# Altium project Measurement of NO2 using an electrochemical sensor.PrjPcb
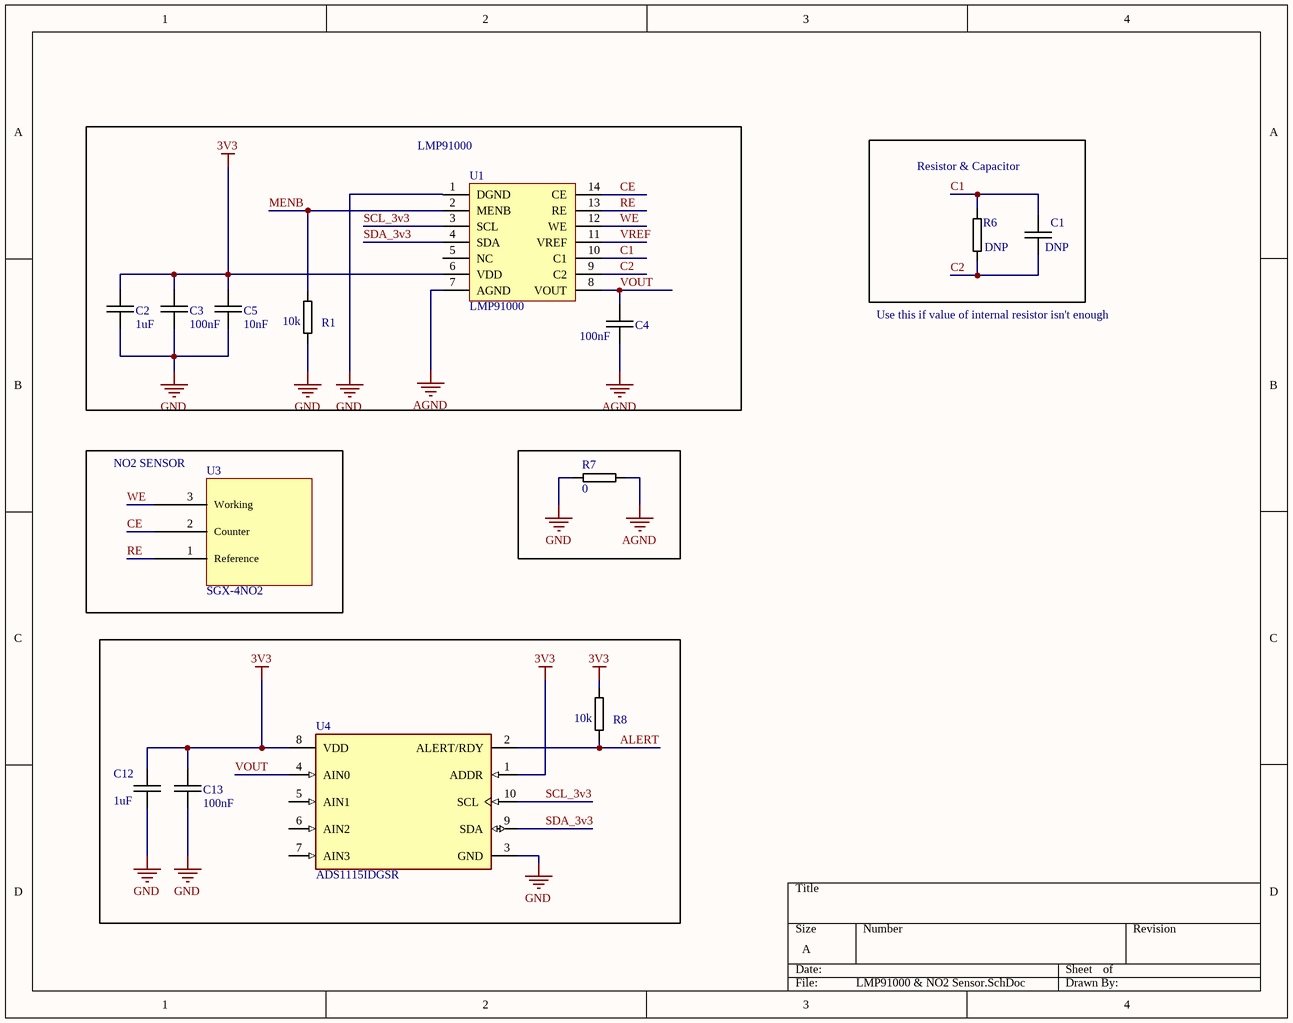
[diagram p0: LMP91000 & NO2 Sensor.SchDoc]
3 sheets, 32 parts. Net scope: global (net labels, ports and power ports of the same name join across sheets).
Board file: PCB.PcbDoc
Sheets:
  LMP91000 & NO2 Sensor.SchDoc
  Communication, connectors & headers.SchDoc
  Voltage supply & reference.SchDoc

## Sheet LMP91000 & NO2 Sensor.SchDoc
size A

### Parts
C1  DNP  [0603C]
C2  1uF  [0603C]
C3  100nF  [0603C]
C4  100nF  [0603C]
C5  10nF  [0603C]
C12  1uF  [0603C]
C13  100nF  [0603C]
R1  10k  [0603R]
R6  DNP  [0603R]
R7  0  [0603R]
R8  10k  [0603R]
U1  LMP91000  [LMP91000]
U3  SGX-4NO2  [SGX-4NO2]
U4  ADS1115IDGSR  [FP-DGS0010A-MFG]

### Blocks framed on the sheet
LMP91000: C2-C5 R1 U1
Resistor & Capacitor: C1 R6
NO2 SENSOR: U3

### Nets
3V3: C2.1 C3.1 C5.1 C12.2 C13.2 R8.2 U1.6(VDD) U4.1(ADDR) U4.8(VDD)
AGND: C4.1 R7.1 U1.7(AGND)
GND: C2.2 C3.2 C5.2 C12.1 C13.1 R1.1 R7.2 U1.1(DGND) U4.3(GND)
ALERT: R8.1 U4.2(ALERT/RDY)
C1: C1.2 R6.2 U1.10(C1)
C2: C1.1 R6.1 U1.9(C2)
CE: U1.14(CE) U3.2(Counter)
MENB: R1.2 U1.2(MENB)
RE: U1.13(RE) U3.1(Reference)
SCL_3v3: U1.3(SCL) U4.10(SCL)
SDA_3v3: U1.4(SDA) U4.9(SDA)
VOUT: C4.2 U1.8(VOUT) U4.4(AIN0)
VREF: U1.11(VREF)
WE: U1.12(WE) U3.3(Working)

Not connected (* = marked no-connect by the designer): U1 5(NC); U4 5(AIN1) 6(AIN2) 7(AIN3)

### Notes on the sheet
- Use this if value of internal resistor isn't enough

### Library data of the parts
C1-C5 C12 C13 = 0603C
R1 R6-R8 = 0603R
U1 = LMP91000: The LMP91000 is a programmable analog front-end(AFE) for use in micro-power electrochemical sensing applications.
U3 = SGX-4NO2: Amphenol SGX Sensortech SGX-4x Electrochemical Sensors are the industrial and commercial gas sensing products.
U4 = CMP-0003-00385-3: IC ADC 16BIT SIGMA-DELTA 10VSSOP; Max Supply Voltage (DC): 5.5V; Resolution: 16b; Interface: I2C; Number of Inputs: 4; Sampling Rate: 860S/s; Integral Nonlinearity (INL): 1LSB; Min Supply Voltage: 2V; Polarity: Bipolar; Conversion Rate: 0.86KS/s; Supply Type: Single; Number of Converters: 1; Number of Bits: 16; Power Dissipation: 900uW; Case/Package: VSSOP; Contact Plating: Gold; RoHS Compliant: Yes; Max Operating Temperature: 125°C; Lead Free: Lead Free; Package Quantity: 2500; Series: -; Min Supply Voltage (DC): 2V; REACH SVHC: No SVHC; Packaging: Tape and Reel; Max Supply Voltage: 5.5V; Radiation Hardening: No; Min Operating Temperature: -40°C; Number of Pins: 10; Number of A/D Converters: 1

## Sheet Communication, connectors & headers.SchDoc
size A
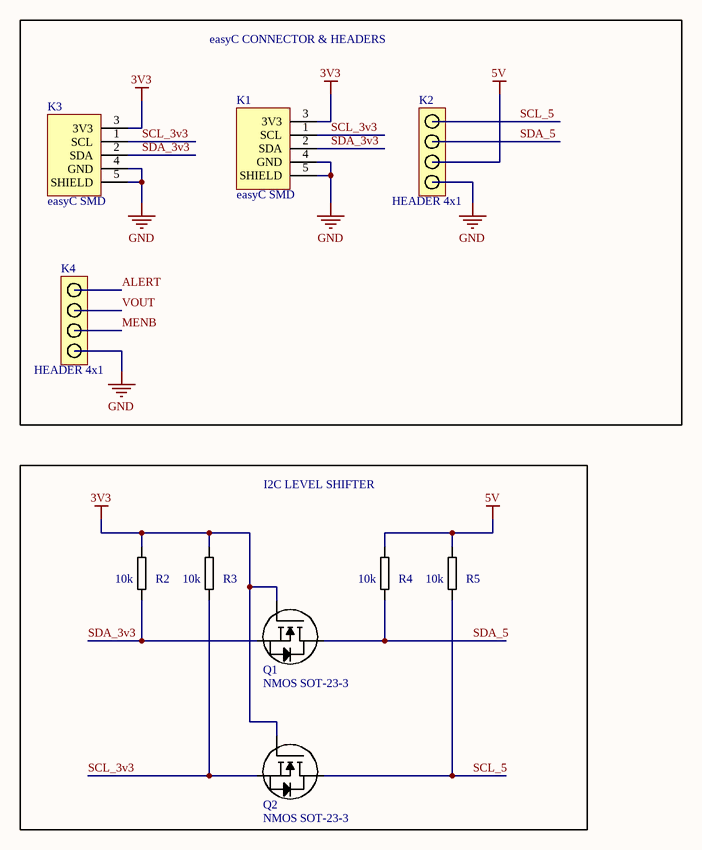
[diagram p1: Communication, connectors & headers.SchDoc]

### Parts
K1  easyC SMD  [EasyC connector]
K2  HEADER 4x1  [HEADER MALE 4x1]
K3  easyC SMD  [EasyC connector]
K4  HEADER 4x1  [HEADER MALE 4x1]
Q1  NMOS SOT-23-3  [SOT-23-3]
Q2  NMOS SOT-23-3  [SOT-23-3]
R2  10k  [0603R]
R3  10k  [0603R]
R4  10k  [0603R]
R5  10k  [0603R]

### Blocks framed on the sheet
easyC CONNECTOR & HEADERS: K1-K4
I2C LEVEL SHIFTER: Q1 Q2 R2-R5

### Nets
3V3: K1.3(3V3) K3.3(3V3) Q1.1(G) Q2.1(G) R2.2 R3.2
5V: K2.3 R4.2 R5.2
GND: K1.4(GND) K1.5(SHIELD) K2.4 K3.4(GND) K3.5(SHIELD) K4.4
ALERT: K4.1
MENB: K4.3
SCL_3v3: K1.1(SCL) K3.1(SCL) Q2.2(S) R3.1
SCL_5: K2.1 Q2.3(D) R5.1
SDA_3v3: K1.2(SDA) K3.2(SDA) Q1.2(S) R2.1
SDA_5: K2.2 Q1.3(D) R4.1
VOUT: K4.2

### Library data of the parts
R2-R5 = 0603R
Q1 Q2 = NMOS SOT-23-3: Supplier 1: Mouser; Supplier 2: Arrow; Supplier 3: Digi-Key; Supplier Part Number 1: 522-ZXMN2A14FTA; Supplier Part Number 2: ZXMN2A14FTA; Supplier Part Number 3: ZXMN2A14FCT-ND

## Sheet Voltage supply & reference.SchDoc
size A
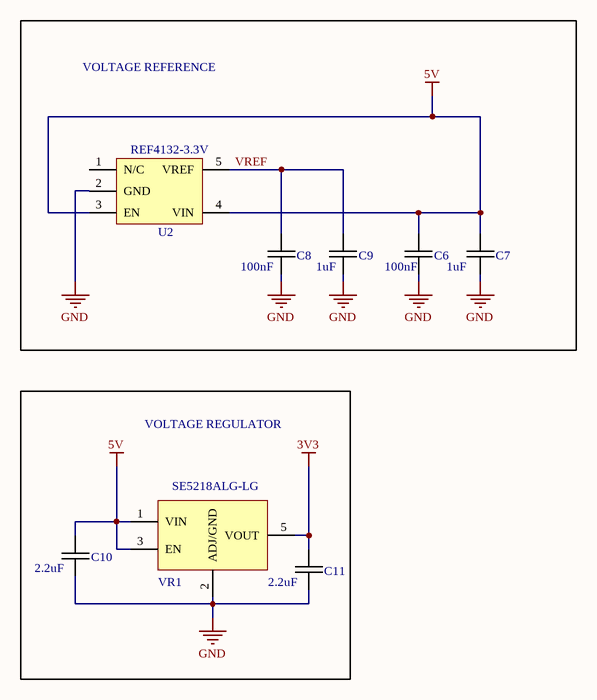
[diagram p2: Voltage supply & reference.SchDoc]

### Parts
C6  100nF  [0603C]
C7  1uF  [0603C]
C8  100nF  [0603C]
C9  1uF  [0603C]
C10  2.2uF  [0603C]
C11  2.2uF  [0603C]
U2  REF4132-3.3V  [SOT-23-5]
VR1  SE5218ALG-LG  [SOT-23-5]

### Blocks framed on the sheet
VOLTAGE REFERENCE: C6-C9 U2
VOLTAGE REGULATOR: C10 C11 VR1

### Nets
3V3: C11.2 VR1.5(VOUT)
5V: C6.2 C7.2 C10.2 U2.3(EN) U2.4(VIN) VR1.1(VIN) VR1.3(EN)
GND: C6.1 C7.1 C8.1 C9.1 C10.1 C11.1 U2.2(GND) VR1.2(ADJ/GND)
VREF: C8.2 C9.2 U2.5(VREF)

Not connected (* = marked no-connect by the designer): U2 1(N/C)

### Library data of the parts
C6-C11 = 0603C
VR1 = VREG 3V3

## Nets that join several sheets
3V3: LMP91000 & NO2 Sensor (9 pins), Communication, connectors & headers (6 pins), Voltage supply & reference (C11.2 VR1.5)
5V: Communication, connectors & headers (K2.3 R4.2 R5.2), Voltage supply & reference (7 pins)
GND: LMP91000 & NO2 Sensor (9 pins), Communication, connectors & headers (6 pins), Voltage supply & reference (8 pins)
ALERT: LMP91000 & NO2 Sensor (R8.1 U4.2), Communication, connectors & headers (K4.1)
MENB: LMP91000 & NO2 Sensor (R1.2 U1.2), Communication, connectors & headers (K4.3)
SCL_3v3: LMP91000 & NO2 Sensor (U1.3 U4.10), Communication, connectors & headers (K1.1 K3.1 Q2.2 R3.1)
SDA_3v3: LMP91000 & NO2 Sensor (U1.4 U4.9), Communication, connectors & headers (K1.2 K3.2 Q1.2 R2.1)
VOUT: LMP91000 & NO2 Sensor (C4.2 U1.8 U4.4), Communication, connectors & headers (K4.2)
VREF: LMP91000 & NO2 Sensor (U1.11), Voltage supply & reference (C8.2 C9.2 U2.5)